# Altium schematic sheet Uart_and_Daylight_Sensor.SchDoc
size A
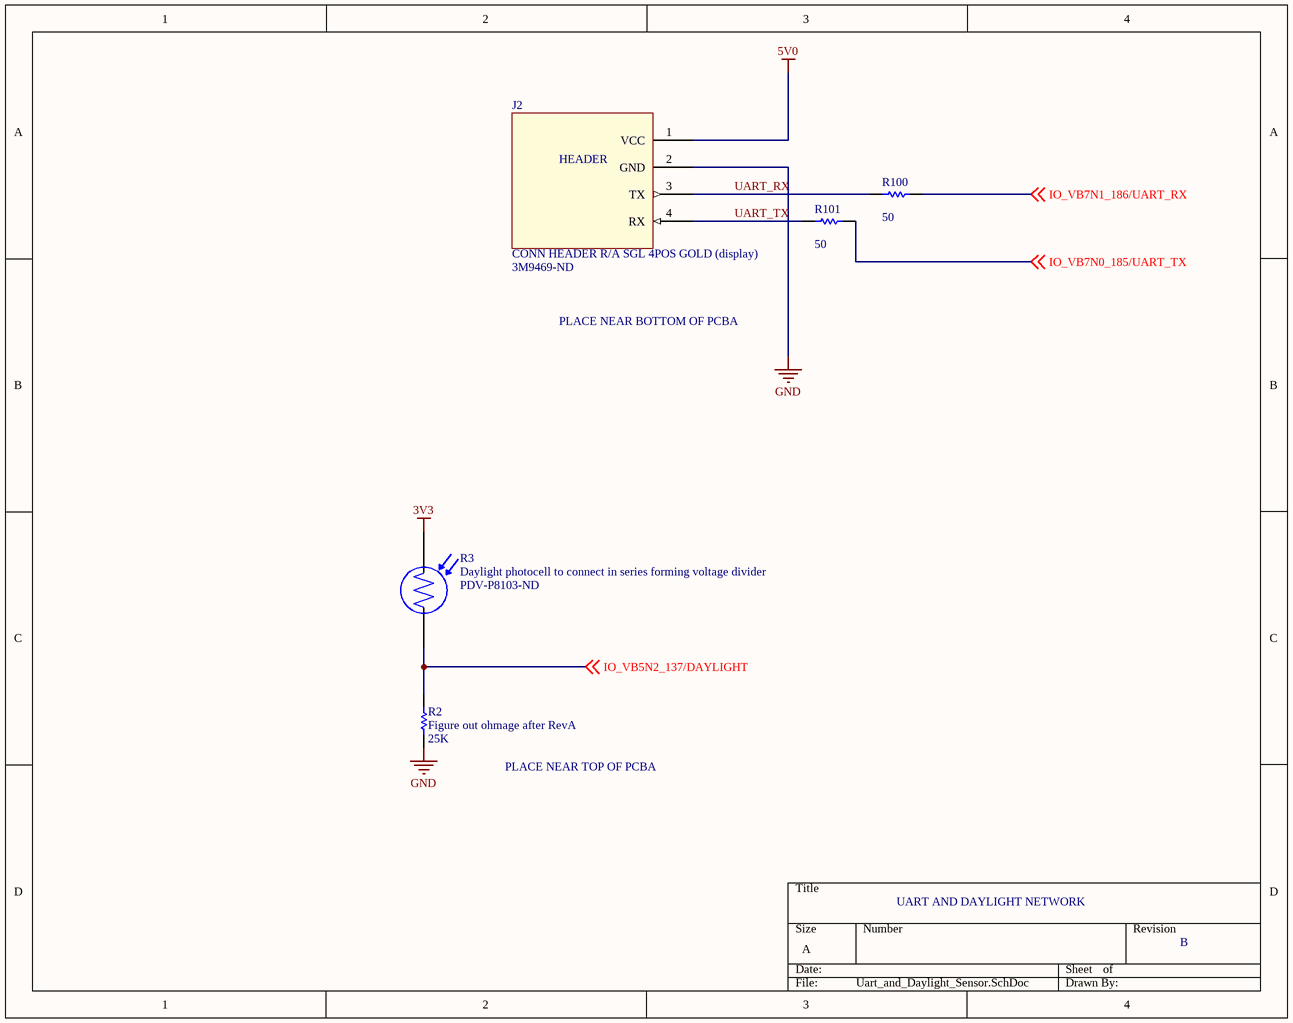
[diagram p0: Uart_and_Daylight_Sensor.SchDoc]

## Parts
J2  CONN HEADER R/A SGL 4POS GOLD (display)  Supplier Part Number 1: 3M9469-ND  [HEADER_4POS_UART]
R2  Figure out ohmage after RevA  value 25K  [RES_0603]
R3  Daylight photocell to connect in series forming voltage divider  Supplier Part Number 1: PDV-P8103-ND  [RES_NSL-19M51]
R100  value 50  [RES_0603]  (hidden comment: 0R)
R101  value 50  [RES_0603]  (hidden comment: Figure out ohmage after RevA)

## Nets
3V3: R3.1
5V0: J2.1(VCC)
GND: J2.2(GND) R2.1
IO_VB5N2_137/DAYLIGHT: R2.2 R3.2 ; off-sheet IO_VB5N2_137/DAYLIGHT
IO_VB7N0_185/UART_TX: R101.1 ; off-sheet IO_VB7N0_185/UART_TX
IO_VB7N1_186/UART_RX: R100.2 ; off-sheet IO_VB7N1_186/UART_RX
UART_RX: J2.3(TX) R100.1
UART_TX: J2.4(RX) R101.2

## Notes on the sheet
- PLACE NEAR BOTTOM OF PCBA
- PLACE NEAR TOP OF PCBA
- UART AND DAYLIGHT NETWORK
- B
- (in symbol CONN HEADER R/A SGL 4POS GOLD (display)) HEADER

## Library data of the parts
J2 = CONN HEADER R/A SGL 4POS GOLD (display): http://multimedia.3m.com/mws/media/548122O/3mtm-pin-strip-header-ts2182.pdf; Supplier 1: Digi-Key
R2 R100 R101 = Res1: Resistor; Published: 8-Jun-2000; LatestRevisionDate: 17-Jul-2002; LatestRevisionNote: Re-released for DXP Platform.; PackageReference: AXIAL-0.3; Publisher: Altium Limited; PackageDescription: Axial Device, Thru-Hole; 2 Leads; 0.3 in Pin Spacing
R3 = PHOTOCELL 16-33KOHM: http://media.digikey.com/pdf/Data%20Sheets/Photonic%20Detetectors%20Inc%20PDFs/PDV-P8103.pdf; Supplier 1: Digi-Key